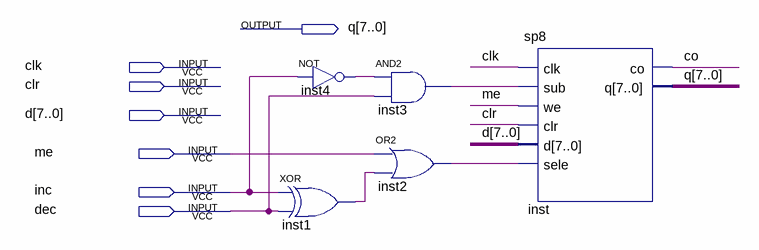
[diagram p0: schematic sheet]
// Quartus schematic sp.bdf as structural Verilog: 5 symbols, 7 pins
module sp (
  input  clk,
  input  clr,
  input  [7:0] d,
  input  me,
  input  inc,
  input  dec,
  output [7:0] q
);

  wire co, inst1_out, inst2_out, inst3_out, inst4_out;

  not inst4 (inst4_out, inc);
  xor inst1 (inst1_out, inc, dec);
  and inst3 (inst3_out, inst4_out, dec);
  or inst2 (inst2_out, me, inst1_out);
  sp8 inst (.clk(clk), .sub(inst3_out), .we(me), .clr(clr), .d(d), .sele(inst2_out), .co(co), .q(q));
endmodule
